# EAGLE design System_Controll (EAGLE 6.4)
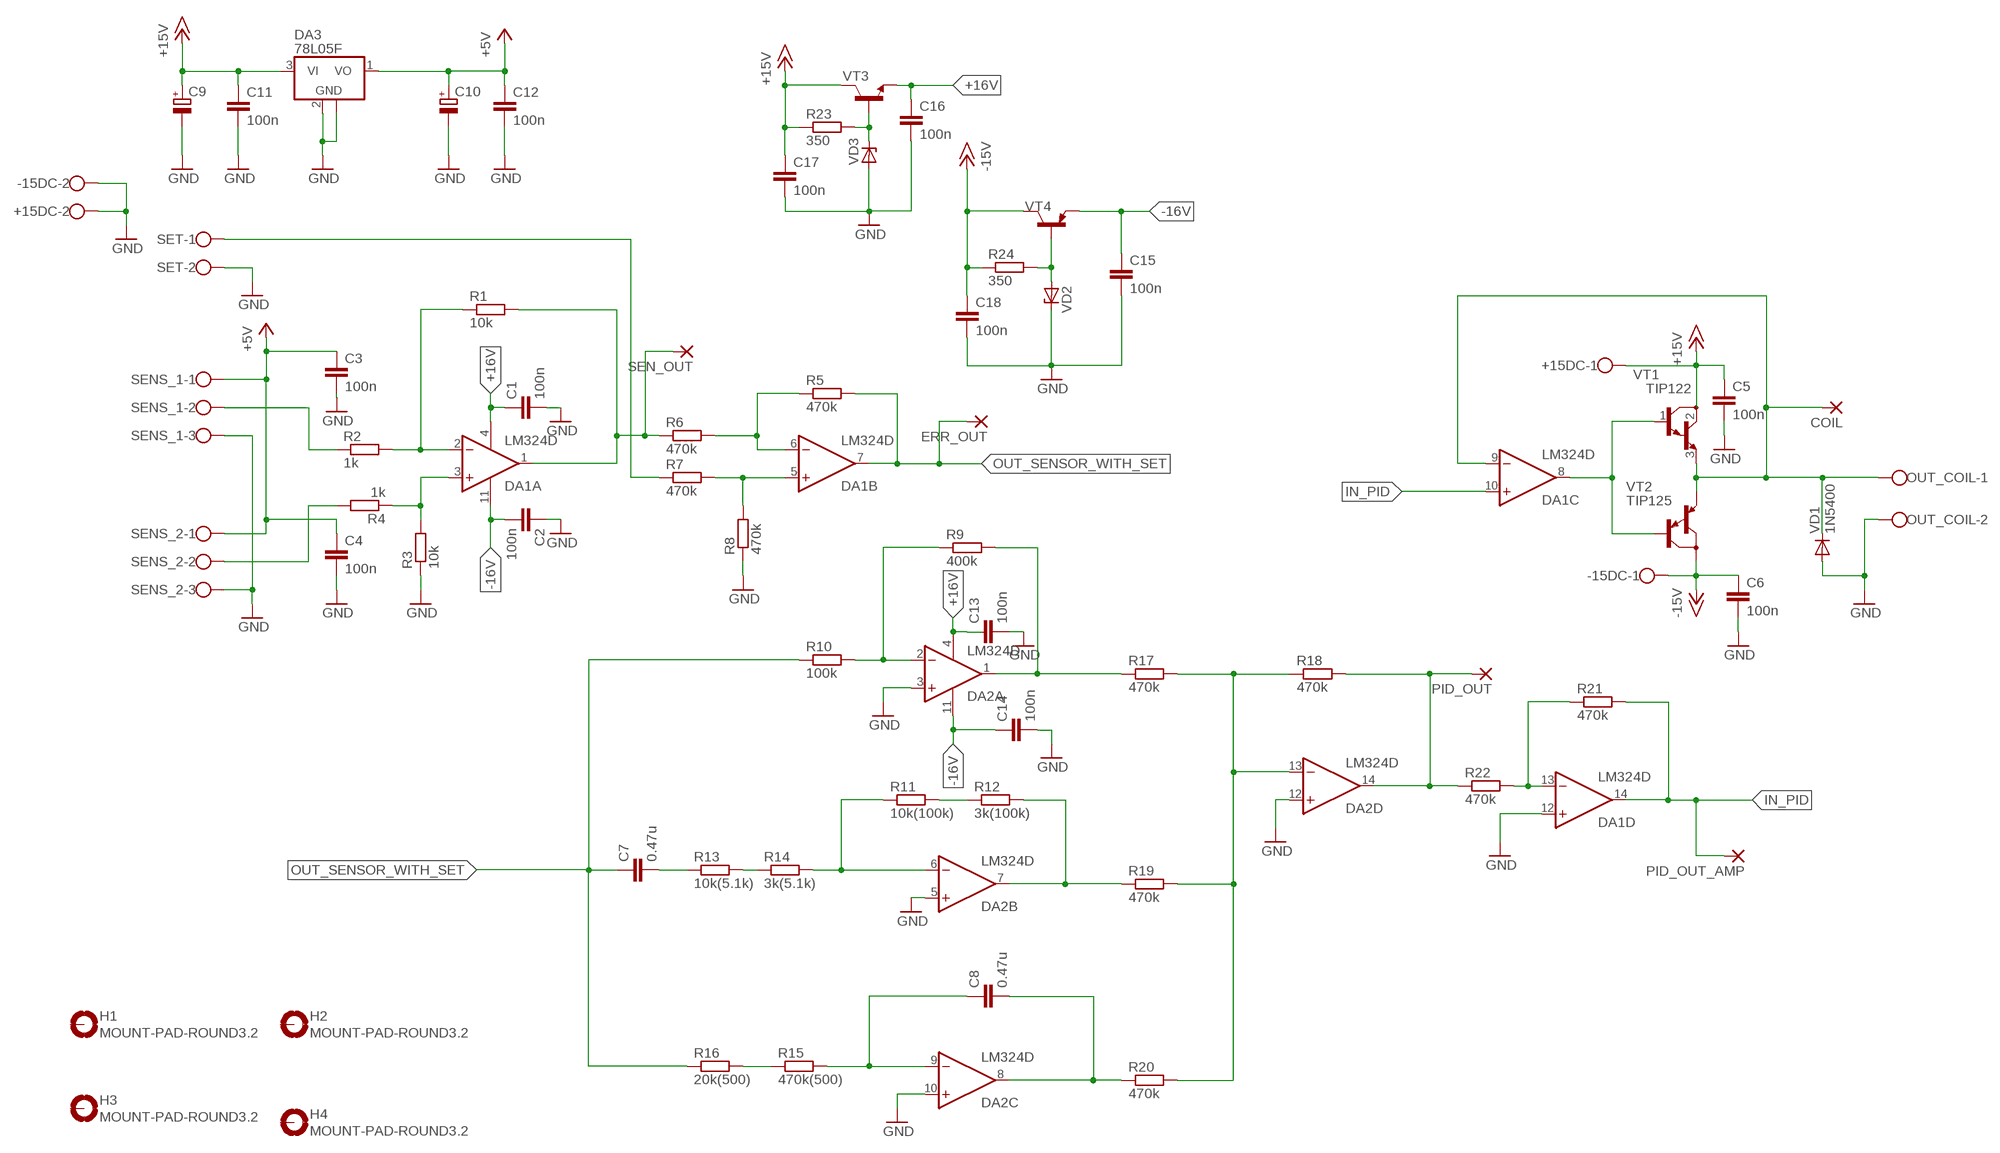
[diagram p0: schematic, sheet 1]

## Parts
+15DC  W237-102  [W237-102]
-15DC  W237-102  [W237-102]
C1  100n  C-EUC1206  [C1206]
C2  100n  C-EUC1206  [C1206]
C3  100n  C-EUC1206  [C1206]
C4  100n  C-EUC1206  [C1206]
C5  100n  C-EUC1206  [C1206]
C6  100n  C-EUC1206  [C1206]
C7  0.47u  C-EUC1206  [C1206]
C8  0.47u  C-EUC1206  [C1206]
C9  CPOL-EUE2,5-6  [E2,5-6]
C10  CPOL-EUE2,5-6  [E2,5-6]
C11  100n  C-EUC1206  [C1206]
C12  100n  C-EUC1206  [C1206]
C13  100n  C-EUC1206  [C1206]
C14  100n  C-EUC1206  [C1206]
C15  100n  C-EUC1206  [C1206]
C16  100n  C-EUC1206  [C1206]
C17  100n  C-EUC1206  [C1206]
C18  100n  C-EUC1206  [C1206]
COIL  PW_PAD  [PW_PAD]
DA1  LM324D  [SO14]
DA2  LM324D  [SO14]
DA3  78L05F  [SOT89]
ERR_OUT  PW_PAD  [PW_PAD]
H1  MOUNT-PAD-ROUND3.2  [3,2-PAD]
H2  MOUNT-PAD-ROUND3.2  [3,2-PAD]
H3  MOUNT-PAD-ROUND3.2  [3,2-PAD]
H4  MOUNT-PAD-ROUND3.2  [3,2-PAD]
OUT_COIL  DG350-3.5-02P  [DG350-3.5-02P]
PID_OUT  PW_PAD  [PW_PAD]
PID_OUT_AMP  PW_PAD  [PW_PAD]
R1  10k  R-EUM1206  [M1206]
R2  1k  R-EUM1206  [M1206]
R3  10k  R-EUM1206  [M1206]
R4  1k  R-EUM1206  [M1206]
R5  470k  R-EUM1206  [M1206]
R6  470k  R-EUM1206  [M1206]
R7  470k  R-EUM1206  [M1206]
R8  470k  R-EUM1206  [M1206]
R9  400k  R-EUM1206  [M1206]
R10  100k  R-EUM1206  [M1206]
R11  10k(100k)  R-EUM1206  [M1206]
R12  3k(100k)  R-EUM1206  [M1206]
R13  10k(5.1k)  R-EUM1206  [M1206]
R14  3k(5.1k)  R-EUM1206  [M1206]
R15  470k(500)  R-EUM1206  [M1206]
R16  20k(500)  R-EUM1206  [M1206]
R17  470k  R-EUM1206  [M1206]
R18  470k  R-EUM1206  [M1206]
R19  470k  R-EUM1206  [M1206]
R20  470k  R-EUM1206  [M1206]
R21  470k  R-EUM1206  [M1206]
R22  470k  R-EUM1206  [M1206]
R23  350  R-EUM1206  [M1206]
R24  350  R-EUM1206  [M1206]
SEN_OUT  PW_PAD  [PW_PAD]
SENS_1  DG350-3.5-03P  [DG350-3.5-03P]
SENS_2  DG350-3.5-03P  [DG350-3.5-03P]
SET  DG350-3.5-02P  [DG350-3.5-02P]
VD1  1N5400  [DO201-15]
VD2  ZENER-DIODEDO41Z10  [DO41Z10]
VD3  ZENER-DIODEDO41Z10  [DO41Z10]
VT1  TIP122  [TO220]
VT2  TIP125  [TO220]
VT3  BC847ALT1SMD  [SOT23]
VT4  BC807-16LT1SMD  [SOT23-BEC]

## Nets
+5V: C3.1 C4.1 C10.+ C12.1 DA3.1(VO) SENS_1.1 SENS_2.1
+15V: +15DC.1 C5.1 C9.+ C11.1 C17.1 DA3.3(VI) R23.1 VT1.2(C) VT3.3(C)
+16V: C1.1 C13.1 C16.1 DA1.4(P:V+) DA2.4(P:V+) VT3.2(E)
-15V: -15DC.1 C6.1 C18.1 R24.1 VT2.2(C) VT4.C
-16V: C2.2 C14.1 C15.1 DA1.11(P:V-) DA2.11(P:V-) VT4.E
COIL_OUT: COIL.P$1(P) DA1.9(C:-IN) OUT_COIL.1 VD1.C VT1.3(E) VT2.3(E)
GND: +15DC.2 -15DC.2 C1.2 C2.1 C3.2 C4.2 C5.2 C6.2 C9.- C10.- C11.2 C12.2 C13.2 C14.2 C15.2 C16.2 C17.2 C18.2 DA1.12(D:+IN) DA2.3(A:+IN) DA2.5(B:+IN) DA2.10(C:+IN) DA2.12(D:+IN) DA3.2(GND) DA3.2@1(GND) OUT_COIL.2 R3.1 R8.1 SENS_1.3 SENS_2.3 SET.2 VD1.A VD2.C VD3.A
IN_PID: DA1.10(C:+IN) DA1.14(D:OUT) PID_OUT_AMP.P$1(P) R21.2
N$1: DA1.1(A:OUT) R1.2 R6.1 SEN_OUT.P$1(P)
N$2: DA1.2(A:-IN) R1.1 R2.2
N$3: DA1.3(A:+IN) R3.2 R4.1
N$4: R2.1 SENS_1.2
N$5: R4.2 SENS_2.2
N$6: DA2.2(A:-IN) R9.1 R10.2
N$7: R7.1 SET.1
N$8: DA1.6(B:-IN) R5.1 R6.2
N$9: DA1.5(B:+IN) R7.2 R8.2
N$11: DA1.8(C:OUT) VT1.1(B) VT2.1(B)
N$12: DA2.1(A:OUT) R9.2 R17.1
N$13: R11.2 R12.1
N$14: DA2.7(B:OUT) R12.2 R19.1
N$15: DA2.6(B:-IN) R11.1 R14.2
N$16: R13.2 R14.1
N$17: C7.2 R13.1
N$18: R24.2 VD2.A VT4.B
N$19: C8.2 DA2.8(C:OUT) R20.1
N$20: C8.1 DA2.9(C:-IN) R15.2
N$21: R15.1 R16.2
N$22: DA2.13(D:-IN) R17.2 R18.1 R19.2 R20.2
N$23: DA2.14(D:OUT) PID_OUT.P$1(P) R18.2 R22.1
N$24: DA1.13(D:-IN) R21.1 R22.2
N$26: R23.2 VD3.C VT3.1(B)
OUT_SENSOR_WITH_SET: C7.1 DA1.7(B:OUT) ERR_OUT.P$1(P) R5.2 R10.1 R16.1
Unconnected: H1.B3,2(MOUNT) H2.B3,2(MOUNT) H3.B3,2(MOUNT) H4.B3,2(MOUNT)

## Library data of the parts
+15DC -15DC = LAMP_RES:W237-102: WAGO SCREW CLAMP; MPN: 237-102; OC_FARNELL: unknown; OC_NEWARK: 70K9898
C1-C8 C11-C18 = Lib_System_Control_AMB:C-EU
C9 C10 = Lib_System_Control_AMB:CPOL-EU
COIL ERR_OUT PID_OUT PID_OUT_AMP SEN_OUT = Lib_System_Control_AMB:PW_PAD: THROUGH-HOLE PAD
DA1 DA2 = Lib_System_Control_AMB:LM324: OP AMP
DA3 = Lib_System_Control_AMB:78L*: POSITOIV-VOLTAGE REGULATORS Output up to 100 mA Source: http://focus.ti.com/lit/ds/symlink/ua78l05.pdf
H1-H4 = LED_CONTROL:MOUNT-PAD-ROUND: MOUNTING PAD, round
OUT_COIL SET = Lib_System_Control_AMB:DG350-3.5-02P: WAGO SCREW CLAMP; MPN: 237-102; OC_FARNELL: unknown; OC_NEWARK: 70K9898
R1-R24 = Lib_System_Control_AMB:R-EU: RESISTOR, European symbol
SENS_1 SENS_2 = Lib_System_Control_AMB:DG350-3.5-03P: WAGO SCREW CLAMP; MPN: 237-103; OC_FARNELL: unknown; OC_NEWARK: 18M7116
VD1 = Lib_System_Control_AMB:1N5400: DIODE standard rectifier, 3 A, 50 V (Motorola)
VD2 VD3 = Lib_System_Control_AMB:ZENER-DIODE: Z-Diode
VT1 = Lib_System_Control_AMB:TIP122*: NPN Darlington Transistor
VT2 = Lib_System_Control_AMB:TIP125: PNP Transistor
VT3 = Lib_System_Control_AMB:BC847*: NPN Transistor
VT4 = Lib_System_Control_AMB:BC807*: PNP Transistror

## Board
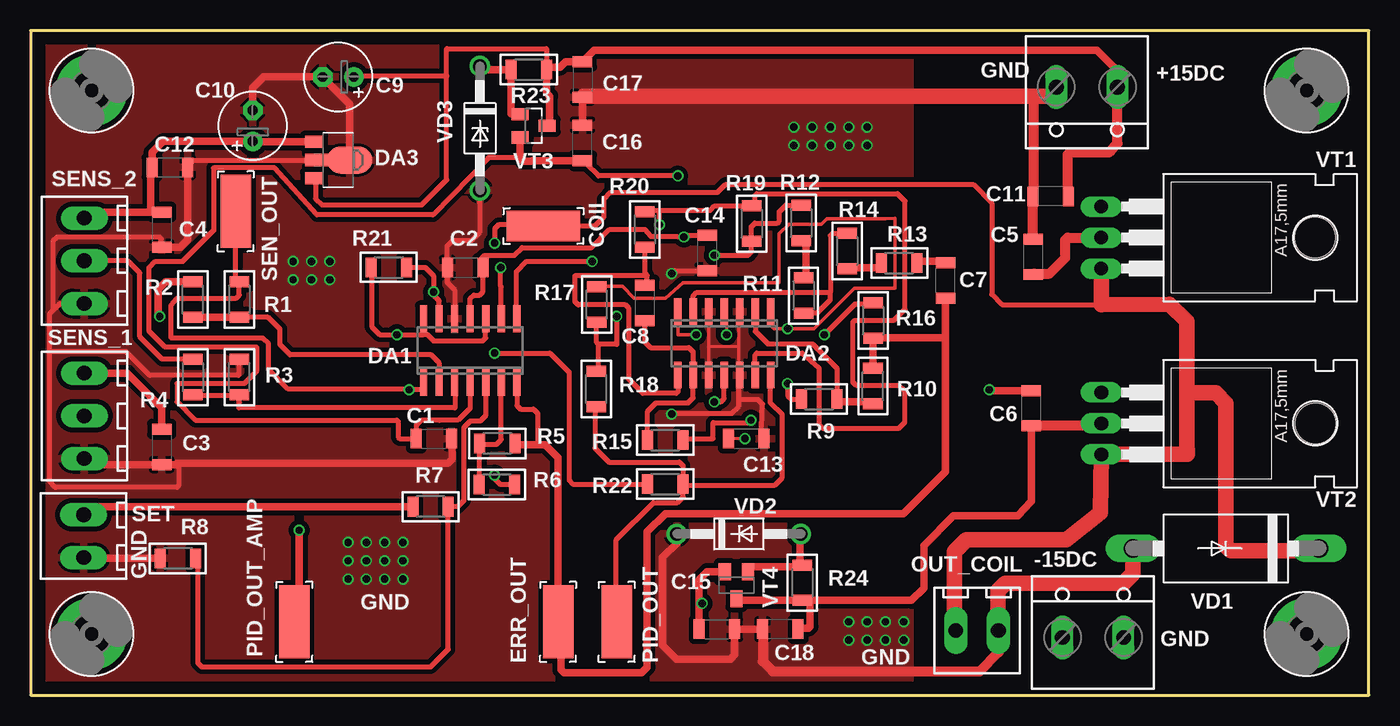
[diagram p1: board, top side]
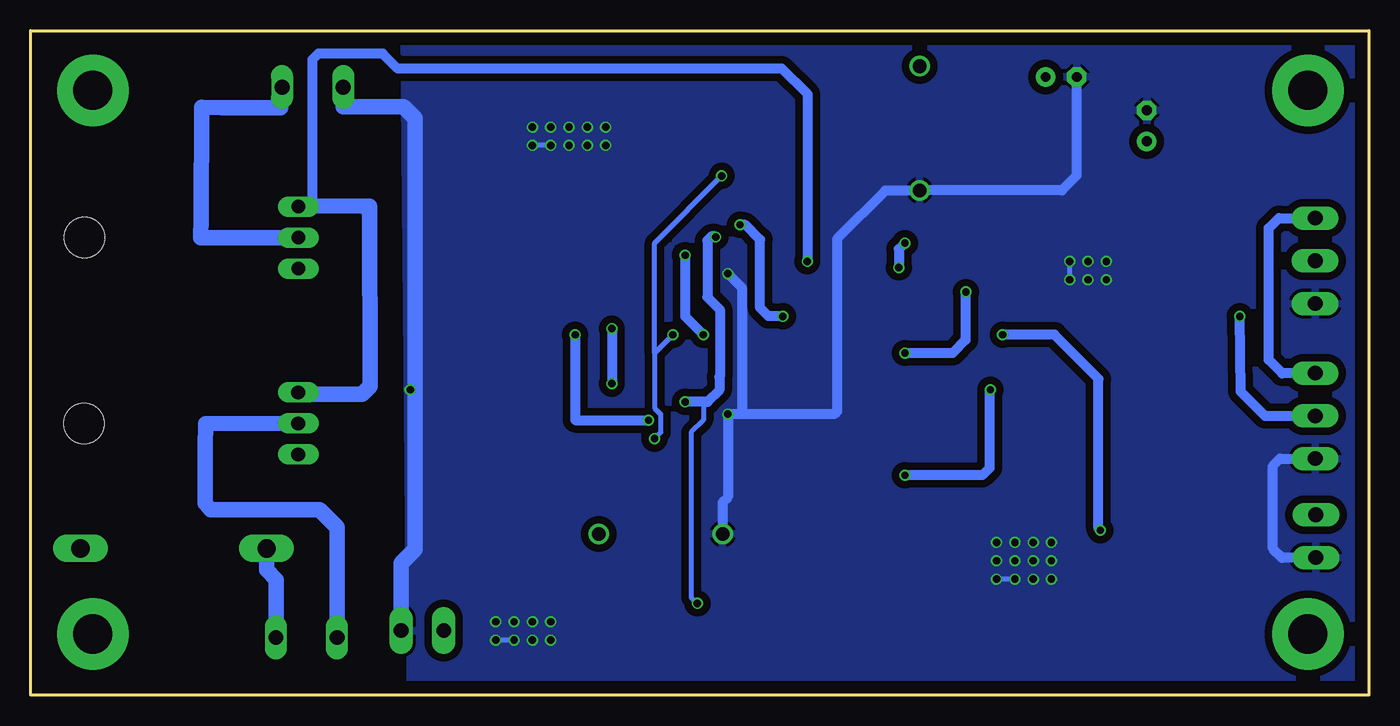
[diagram p2: board, bottom side, seen from below]

Size 109.6 x 54.4 mm. Coordinates in mm from the lower left corner, seen from the top.
Outline: 0,0 109.6,0 109.6,54.4 0,54.4 0,0
Copper layers (1*16): Top 0.035mm / dielectric 1.5mm / Bottom 0.035mm
Design rules "default *": minimum track width 8mil, minimum drill 0.6mm, track to track 8mil, track to pad 8mil, pad to pad 8mil, via to via 8mil, smd to smd 8mil, copper to edge 40mil, drill to drill 8mil, minimum pad ring 10mil, minimum via ring 4mil, stop-mask expansion 4mil, vias tented up to drill 0mil, thermal gap 10mil

### Footprints (pad centres in the part's own frame; a part is rotated, then mirrored left to right if it is on the bottom)
W237-102 = drill 1.2 long: 1 -2.5,-1.27; 2 2.5,-1.27
C1206 = smd 0.9 x 1.6: 1 -1.45,0; 2 1.45,0
E2,5-6 = drill 0.8 pad 1.6: + -1.27,0 | drill 0.8 pad 1.6 octagon: - 1.27,0
PW_PAD = smd 6 x 2.5: P$1 0,0
SO14 = smd 0.6 x 2.2: 1 -3.81,-2.6; 2 -2.54,-2.6; 3 -1.27,-2.6; 4 0,-2.6; 5 1.27,-2.6; 6 2.54,-2.6; 7 3.81,-2.6; 8 3.81,2.6; 9 2.54,2.6; 10 1.27,2.6; 11 0,2.6; 12 -1.27,2.6; 13 -2.54,2.6; 14 -3.81,2.6
SOT89 = smd 1 x 1.5: 1 -1.499,-1.981; 3 1.499,-1.981 | smd 1 x 2: 2 0,-1.727 | smd 2.2 x 3.7: 2@1 0,0.94
3,2-PAD = drill 3.2 pad 5.842: B3,2 0,0
DG350-3.5-02P = drill 1.2 pad 1.93 long: 1 -1.75,0; 2 1.75,0
M1206 = smd 0.9 x 1.6: 1 -1.45,0; 2 1.45,0
DG350-3.5-03P = drill 1.2 pad 1.93 long: 1 -3.5,0; 2 0,0; 3 3.5,0
DO201-15 = drill 1.499 long: A 7.62,0; C -7.62,0
DO41Z10 = drill 1.118: A 5.08,0; C -5.08,0
TO220 = drill 1.118 long: 1 -2.54,-6.35; 2 0,-6.35; 3 2.54,-6.35 | hole 3.302: 0,11.176
SOT23 = smd 1 x 1.4: 1 -0.95,-1.1; 2 0.95,-1.1; 3 0,1.1
SOT23-BEC = smd 1 x 1.4: B -0.95,-1.1; C 0,1.1; E 0.95,-1.1

### Placement (x,y rotation side)
+15DC  86.5,48.49 180 top
-15DC  87,6 0 top
C1  33.04,20.99 0 top
C2  35.6,35 0 top
C3  10.75,20.32 270 top
C4  10.75,38.09 270 top
C5  82.11,35.88 90 top
C6  81.95,23.48 90 top
C7  74.92,33.95 90 top
C8  50.31,32.11 90 top
C9  25.2,50.6 180 top
C10  18.2,46.6 90 top
C11  83.53,40.83 180 top
C12  11.4,43.2 0 top
C13  58.6,21 0 top
C14  55.4,36.2 270 top
C15  56.2,5.4 0 top
C16  45.2,45.2 90 top
C17  45.2,50.4 270 top
C18  61.4,5.4 180 top
COIL  42,38.4 0 top
DA1  36,28.2 0 top
DA2  56.8,28.8 180 top
DA3  25.2,43.8 270 top
ERR_OUT  43.2,6 90 top
H1  5,49.5 0 top
H2  5,5 0 top
H3  104.5,5 0 top
H4  104.5,49.5 0 top
OUT_COIL  77.51,5.28 0 top
PID_OUT  48,6 90 top
PID_OUT_AMP  21.6,6 90 top
R1  17.1,32.38 90 top
R2  13.29,32.38 270 top
R3  17.1,26.03 270 top
R4  13.29,26.03 90 top
R5  38.23,20.6 0 top
R6  38.18,17.24 180 top
R7  32.76,15.42 0 top
R8  12.06,11.19 0 top
R9  64.57,24.23 180 top
R10  68.98,25.3 270 top
R11  63.3,32.7 90 top
R12  63.1,38.65 90 top
R13  71.14,35.36 180 top
R14  66.87,36.35 90 top
R15  51.98,20.87 180 top
R16  68.99,30.66 90 top
R17  46.36,31.98 270 top
R18  46.32,25.06 270 top
R19  59.05,38.59 90 top
R20  50.3,38.12 90 top
R21  29.33,35.02 180 top
R22  51.98,17.28 180 top
R23  40.8,51.2 180 top
R24  63.2,9.2 90 top
SEN_OUT  16.8,39.6 270 top
SENS_1  4.4,22.86 270 top
SENS_2  4.4,35.55 270 top
SET  4.35,13.01 270 top
VD1  97.89,12.01 180 top
VD2  58,13.2 0 top
VD3  36.8,46.4 270 top
VT1  94.02,37.45 270 top
VT2  94.03,22.24 270 top
VT3  41.2,46.6 270 top
VT4  57.8,9 180 top

### Tracks (layer width: path | path; a pad name or v marks a point on that pad's centre or on a via)
+5V
  Top 0.254: 10.5,22 C3.1 | 23,45.5 DA3.1
  Top 0.406: SENS_1.1
  Top 0.61: SENS_2.1 4.89,39.55 9.84,39.55 | 9.84,39.55 C4.1 | 9.84,39.55 9.84,43.09 C12.1 9.96,44.42 10.87,45.33 C10.+ 18.23,45.3 DA3.1 | SENS_1.1 7.93,26.36 10.75,23.54 C3.1
  Bottom 0.406: SENS_1.1 4.42,26.34
  Bottom 0.813: 4.42,26.34 7.11,26.34 8.21,27.44 8.21,38.22 7.38,39.05 SENS_2.1
+15V
  Top 0.254: 85,41 C11.1 | 89,48 +15DC.1 | 23.5,42 DA3.3 | 42,46.5 VT3.3 | 45,51.5 C17.1 | 42.5,51.5 R23.1
  Top 0.406: 23.5,42 23.34,41.84 23.34,40.64 23.86,40.12 32.04,40.12 34.07,42.18 34.07,50.68 | 34.07,50.68 34.07,52.92 42.25,52.92 R23.1 | C9.+ 26.55,50.68 34.07,50.68 | 88.22,51.89 88.23,51.89
  Top 0.61: 42.5,51.5 42.59,51.41 43.37,51.41 43.81,51.85 C17.1 45.24,51.89 46.13,52.78 87.33,52.78 88.22,51.89 | 88.23,51.89 89.1,51.02 +15DC.1 | VT3.3 42.51,46.81 42.51,49.03 42.25,49.29 R23.1 | 85,41 85.05,40.95 | C5.1 82.13,34.45
  Top 0.813: 85.05,40.95 84.93,41.07 84.93,44.25 85.13,44.45 88.38,44.45 89.01,45.16 +15DC.1 | 82.13,34.45 82.18,34.5 83.44,34.5 84.73,35.79 84.73,37.27 84.91,37.45 VT1.2
  Bottom 1.27: +15DC.1 89.13,48.1 93.93,48.1 95.6,48.13 95.64,39.09 95.65,37.44 VT1.2
+16V  (via drill 0.6)
  Top 0.254: 40.5,45.5 VT3.2 | 57,21 C13.1 v58.5,21 | v57,29.5 57,31 DA2.4 | 45.5,43.5 C16.1 | 31.5,21 C1.1
  Top 0.406: DA1.4 36,23.5 35,22.5 33.5,22.5 33.49,22.49 31.98,22.49 31.59,22.1 31.59,21.13 C1.1 30.24,20.99 30.12,21.11 30.12,22.38 30,22.5 13.5,22.5 12,24 12,25.5 17.5,25.5 18.5,26.5 18.5,28.5 11,28.5 9.7,29.8 9.7,34.99 10.21,35.5 12,35.5 12.01,35.51 12.46,35.51 15,38.05 14.98,43.16 19.98,43.16 23.45,39.31 32.95,39.31 37.5,44 40.1,44 | 45.5,43.5 46.5,42.5 v53,42.5
  Top 0.61: C16.1 45.18,43.73 41.02,43.73 41,43.71 40.32,43.71 40.1,43.93 40.1,44 VT3.2
  Bottom 0.406: v58.5,21 58,21.5 58,23 58.5,23.5 58.5,28 | v57,29.5 58.5,28 | v53,42.5 58.5,37 58.5,28
-15V
  Top 0.254: 82,22 C6.1 81.5,22 | 58,8 VT4.C | 63,5.5 C18.1
  Top 0.61: 57.92,7.92 57.78,7.79 57.78,7.62 | 82,22 82.01,21.99 82.02,22.11 | 63.84,7.75 72.15,7.75 73.15,8.75 73.15,12.24 75.59,14.68 80.87,14.68 81.9,15.81 81.95,15.88 C6.1 | 63.84,7.75 R24.1 58.15,7.75 57.92,7.52 57.92,7.92 | 63,5.5 63.02,5.48 63.72,5.48 63.84,5.6 63.84,7.75 | 58,8 57.92,7.92
  Top 0.813: 82.02,22.11 82.05,22.08 83.97,22.08 87.68,22.07 VT2.2
  Bottom 1.27: VT2.2 95.27,22.23 95.28,20.3 95.28,20.19 95.3,15.72 94.83,15.17 85.94,15.17 84.5,13.73 -15DC.1
-16V  (via drill 0.6)
  Top 0.254: 55,37.5 C14.1 | 37,35 C2.2 | 56.5,10 VT4.E | v55,7.5 54.73,7.5
  Top 0.406: DA1.11 36,32.47 36.28,32.75 36.77,32.75 37.05,33.03 C2.2 | 37,35 36.97,35.03 36.97,35.8 37.16,35.99 39.6,35.99 40.24,36.63 45.94,36.63 47.43,38.12 49.81,38.12 49.82,38.13 50.28,38.13 50.77,37.55 52.9,37.55 53.04,37.5 v53.5,37.5 53.65,37.65 C14.1 | v56,24 56.02,24.02 56.55,24.02 56.8,24.27 DA2.11
  Top 0.61: VT4.E 55.4,10.1 54.73,9.43 54.73,7.5 54.73,5.42 C15.1
  Bottom 0.406: v55,7.5 55.5,8 55.5,21.5 54.5,22.5 54.5,24
  Bottom 0.813: v53.5,37.5 53.56,37.56 53.85,37.56 54.18,37.23 54.18,32.57 53.16,31.55 53.16,26.08 53.2,26.04 53.2,24.96 54.16,24 54.5,24 v56,24
COIL_OUT  (via drill 0.6)
  Top 0.254: 38.5,31 DA1.9 | 42,38 COIL.P$1 42,38.5
  Top 0.406: 42,38 41.5,38.5 38.32,38.5 38,38.18 v38,37 | 42,38.5 42.06,38.44 46.24,38.44 46.95,39.15 46.95,40.61 47.49,41.15 56.25,41.15 56.91,41.81 77.19,41.81 78.72,40.28 78.72,32.8 79.55,31.97 87.67,31.97 | 38.5,31 38.55,31.05 38.55,33.42 38.5,33.47 v38.5,35
  Top 1.27: OUT_COIL.1 75.66,5.38 75.66,11.75 76.63,12.72 84.83,12.72 87.61,14.94 VT2.3 94.71,19.71 94.68,20.73 94.68,24.74 | VT1.3 87.67,31.97 93.27,31.98 94.68,30.61 94.68,24.74 | VD1.C 105.3,11.8 98.3,11.8 97.89,12.21 97.89,23.9 97.05,24.74 94.68,24.74
  Bottom 0.813: v38,37 38.5,36.5 v38.5,35
GND  (via drill 0.6)
  Top 0.254: 81.5,25 C6.2 | 17,27.5 R3.1 | 4.5,32 SENS_2.3 | 10.5,11.5 R8.1 | 10.5,19 C3.2 11,19 | 34.5,20.5 C1.2 | 55.5,28.5 55.5,31 DA2.5 | 55.5,28.5 55.5,26.5 DA2.10 | 58,25.5 58,26 DA2.12 58,26.5 58,28.5 | 60,21 C13.2 | 58,28.5 58,31 DA2.3 | 58,28.5 55.5,28.5 | 60,5.5 C18.2 60,5 | 55,34.5 C14.2 | 57.5,5 C15.2 | 12.5,43 C12.2 13,43.5 | 24.5,44 26,44 DA3.2@1 24.5,44 | 24.5,44 23.5,44 DA3.2 | 24,50.5 C9.- | 79,5 OUT_COIL.2
  Top 0.406: DA1.12 34.76,30.83 34.76,33.13 34.15,33.74 C2.1 34.2,35.05 34.12,35.13 34.12,36.76 34.59,37.23 36.13,37.23 36.8,37.9 VD3.A | 13,43.5 13.3,43.8 DA3.2 | 10.5,19 10.35,18.85 | SET.2 4.42,11.19 | 12,19 12.13,18.87 12.13,17.13 12.01,17.01 2.04,17.01 1.56,17.49 1.56,28.11 | 1.56,28.11 1.56,31.21 1.82,31.47 | 1.82,31.47 2.4,32.05 SENS_2.3 | 17,27.5 17.06,27.44 17.06,26.2 17.04,26.18 9.77,26.18 7.84,28.11 1.56,28.11 | C4.2 10.71,36.69 10.71,37.34 10.56,37.49 2.17,37.49 1.82,37.14 1.82,31.47 | v52.5,23 52.56,23.06 57.41,23.06 58,23.65 58,24.19 | 58,24.19 58,25.5 | 60,21 59.83,21.02 59.95,23.82 59.58,24.19 58,24.19 | v52.5,34.5 52.75,34.75 C14.2
  Top 0.61: v78.5,25 78.57,24.93 C6.2 | C15.2 C18.2 | 60,5 59.97,4.97 | 57.5,5 57.66,4.84 57.66,3.29 57.32,2.95 52.91,2.95 51.77,4.09 51.77,11.28 52.92,12.43 VD2.C | C16.2 C17.2 45.28,49.03 | 83.89,49.03 84.1,48.82 | C11.2 82.15,40.9 | C5.2 82.08,37.36 | C10.- 18.19,49.71 19.08,50.6 C9.- | 24,50.5 26.14,48.36 DA3.2@1 | C4.2 10.79,36.68 12.25,36.68 12.85,37.28 C12.2 | 10.35,18.85 5.1,18.85 4.59,19.36 SENS_1.3 | 4.42,11.19 R8.1 | 34.5,20.5 34.5,19.29 34.21,19 12,19 11.87,18.86 C3.2
  Top 0.813: 59.97,4.97 59.97,2.77 60.79,1.95 77.72,1.95 79.26,3.49 OUT_COIL.2 | 82.15,40.9 82.15,49.03 | 82.08,37.36 C11.2
  Top 1.27: OUT_COIL.2 79.22,5.32 79.22,8.54 79.82,9.14 89.47,9.14 90.27,9.94 VD1.A | 45.28,49.03 82.15,49.03 83.89,49.03 | 84.1,48.82 +15DC.2
  Bottom 0.254: v78.5,25 78.12,25
  Bottom 0.406: SET.2 4.38,11.23 | v29,9.5 v30.5,9.5 | v24.5,34 v24.5,35.5 | v67,45 v68.5,45 | v70,4.5 v71.5,4.5
  Bottom 0.813: 4.38,11.23 7.11,11.23 7.87,11.99 7.87,18.77 7.29,19.36 SENS_1.3 | C9.- 23.94,42.52 25.14,41.32 VD3.A 36.82,41.3 39.61,41.3 43.56,37.35 43.56,23.22 43.78,23 51.36,23 | 51.36,23 v52.5,23 v52.49,22.99 52.49,16.2 52.92,15.77 VD2.C | v52.5,34.5 51.36,33.36 51.36,23
  Bottom 1.27: -15DC.2 89.47,4.76 89.47,9.46 90.27,10.26 VD1.A | +15DC.2 84.01,48.16 79.04,48.16 78.12,47.24 78.12,25 78.12,11.92 79.26,10.78 OUT_COIL.2
  other vias: 26,12.5 27.5,12.5 29,12.5 30.5,12.5 26,11 27.5,11 29,11 30.5,11 26,9.5 27.5,9.5 21.5,35.5 21.5,34 23,34 23,35.5 62.5,46.5 62.5,45 64,46.5 64,45 65.5,46.5 65.5,45 67,46.5 68.5,46.5 67,6 68.5,6 70,6 71.5,6 67,4.5 68.5,4.5
  pour Top (isolate 0.4): 1.5,53.5 1.5,1 72,1 72,53.5
  pour Bottom (isolate 0.61): 1,53.5 1,1 78.5,1 79,53.5
IN_PID  (via drill 0.6)
  Top 0.254: 28,35 R21.2 | 22,6 PID_OUT_AMP.P$1
  Top 0.406: 32.2,29.5 v30,29.5 28.6,29.5 27.94,30.16 27.94,34.94 28,35 | 32.2,29.5 32.19,29.51 DA1.14 | 32.2,29.5 32.5,29.5 33,29 37.03,29 37.27,29.24 DA1.10
  Top 0.61: v22,13.5 22,6
  Bottom 0.406: v22,13.5 22.14,13.64
  Bottom 0.813: 22.14,13.64 22.14,25.88 25.76,29.5 v30,29.5
N$1  (via drill 0.6)
  Top 0.254: 17,34 R1.2 17,33.5 | 17,39.5 SEN_OUT.P$1 | 39.5,17.5 R6.1
  Top 0.406: DA1.1 32.17,25.58 32.17,24.94 32.11,25 v31,25 30.96,25.04 21.1,25.04 19.48,26.66 19.48,28.77 19.02,29.23 11.52,29.23 11.51,29.33 11.51,31.9 12.01,32.49 16.84,32.49 17.1,32.75 R1.2 | 17,34 16.8,34.2 SEN_OUT.P$1 | 39.5,17.5 39.24,17.24 38.47,17.24 38,17.71 v38,18
  Bottom 0.406: v31,25 31.07,24.93
  Bottom 0.813: 31.07,24.93 31.07,18.59 31.66,18 v38,18
N$2
  Top 0.254: 13.5,31 R2.2 | 17,31 R1.1 | 33.5,26 DA1.2
  Top 0.406: 33.5,26 33.48,26.02 33.48,27.16 32.79,27.85 21.25,27.85 20.42,28.68 20.42,29.95 19.44,30.93 R1.1
  Top 0.61: 13.5,31 13.57,30.93 R1.1
N$3
  Top 0.254: 13.5,24.5 R4.1 | 17,24.5 R3.2
  Top 0.406: 17,24.5 13.5,24.5 | DA1.3 34.75,25.58 34.75,23.52 17.07,23.52 17.1,23.96 R3.2
N$4  (via drill 0.6)
  Top 0.254: 13,33.5 R2.1
  Top 0.61: v10.57,31 10.47,31.03 10.47,33.24 11.06,33.83 R2.1
  Bottom 0.406: SENS_1.2 4.42,22.83
  Bottom 0.813: 4.42,22.83 8.49,22.83 10.5,24.84 v10.57,31
N$5
  Top 0.254: 13,27.5 R4.2
  Top 0.406: 13,27.5 12.99,27.51 10.77,27.51 8.94,29.34 8.94,34.56 7.95,35.55 SENS_2.2
N$6
  Top 0.254: 68.5,24 R10.2 | 66,24 R9.1 66,24.5
  Top 0.406: DA2.2 59.35,29.78 60.38,28.75 64.03,28.75 66.02,26.76 R9.1
  Top 0.61: 66,24 68.5,24
N$7
  Top 0.254: 31,15 R7.1
  Top 0.61: SET.1 5.01,15.42 R7.1
N$8
  Top 0.254: 37,20.5 R5.1 | 38.5,25.5 DA1.6
  Top 0.406: DA1.6 38.54,20.91 38.16,20.53 36.85,20.53 R5.1 36.78,17.29 R6.2
N$9
  Top 0.254: 34.5,15.5 R7.2
  Top 0.406: R8.2 13.69,11.01 13.69,2.64 14.02,2.31 32.77,2.31 34.21,3.75 R7.2 34.99,15.42 35.48,15.91 35.48,21.89 36.01,22.42 36.83,22.42 37.26,22.85 DA1.5
N$11  (via drill 0.6)
  Top 0.406: DA1.8 39.78,30.83 39.78,34.67 40.61,35.5 v46,35.5
  Bottom 0.813: v46,35.5 45.95,35.55 45.95,49.17 48.07,51.29 79.53,51.29 80.76,52.52 86.03,52.52 86.53,52.02 86.53,50.6 86.53,50.1 86.53,40.05
  Bottom 1.27: VT2.1 86.55,24.62 82.46,24.62 81.8,25.28 81.83,40.01 82.42,40.01 86.53,40.05 VT1.1
N$12  (via drill 0.6)
  Top 0.254: 63,24.5 R9.2
  Top 0.305: 60.6,30.29 60.89,30 v62,30 64.16,30 67.45,33.29 70.78,33.29 70.78,39.02 70,39.01 65.23,39.01 64.78,38.56 62.1,38.56 61.29,37.75 61.29,33.77 53.44,33.77 52,32.5 49.41,32.5 48.46,33.45 46.38,33.45 R17.1
  Top 0.406: v62,25.5 62,24.52 62.29,24.23 R9.2 | DA2.1 60.6,30.29
  Bottom 0.813: v62,30 v62,25.5
N$13
  Top 0.254: 63.5,34.5 R11.2 | 63.5,37 R12.1
  Top 0.61: 63.5,37 63.5,34.5
N$14  (via drill 0.6)
  Top 0.254: 63,40 R12.2 | 53,31 DA2.7 | 59,37 R19.1
  Top 0.305: 53,31 53,29.5 v54.5,29.5
  Top 0.406: v56,36 v56.01,36.01 58.78,36.01 59.05,36.28 R19.1 59.03,37.16 59.03,38.35 59.32,38.64 61.16,38.64 61.32,38.8 61.32,39.57 61.85,40.1 R12.2
  Bottom 0.813: v54.5,29.5 56,31 v56,36
N$15
  Top 0.254: 63.5,31.5 R11.1
  Top 0.406: 63.5,31.5 63.7,31.3 64.44,31.3 65.5,32.36 65.5,32.96 | DA2.6 54.25,32.66 54.55,32.96 65.5,32.96 | 65.5,32.96 65.5,37.61 65.67,37.78 66.22,37.78 66.24,37.8 R14.2
N$16
  Top 0.254: 67,35 R14.1 | 69.5,35 R13.2
  Top 0.61: 69.5,35 67,35
N$17
  Top 0.254: 73,35.5 R13.1 | 74.5,35.5 C7.2
  Top 0.61: 74.5,35.5 73,35.5
N$18
  Top 0.254: 59,10.5 VT4.B | 63,10.5 R24.2
  Top 0.61: 63,10.5 59,10.5 | R24.2 63,11 63,13 VD2.A
N$19
  Top 0.254: 50.5,36.5 R20.1 | 53,26 DA2.8
  Top 0.406: DA2.8 53,26.17 53,26 53,24.81 52.88,24.69 50.15,24.69 49,25.84 49,31.66 48.72,31.94 44.85,31.94 44.58,32.21 44.58,34.29 44.64,34.35 50.5,34.35 | C8.2 50.5,33.75 50.5,34.35 | 50.5,34.35 50.3,34.55 R20.1
N$20
  Top 0.254: 50.5,21 R15.2 | 50.5,30.5 C8.1
  Top 0.406: 50.5,21 50.53,21.03 50.53,23.25 51.2,23.92 53.85,23.92 54.26,24.33 DA2.9 54.26,28.09 53.91,28.44 50.75,28.44 50.31,28.88 C8.1 | 50.5,30.5 50.52,30.48
N$21  (via drill 0.6)
  Top 0.254: 53.5,21 R15.1 | 68.5,32 R16.2
  Top 0.406: v65,29.5 67.5,32 68.5,32 | 53.5,21 55.89,21 55.89,22.3 59,22.3 v59,22.5
  Bottom 0.813: v59,22.5 65,22.5 v65,29.5
N$22  (via drill 0.6)
  Top 0.254: 46.5,26.5 R18.1 | 59.5,40 R19.2 | 46.5,30.5 R17.2 | 50.5,39.5 R20.2
  Top 0.406: 50.5,39.5 50.68,39.68 51.49,39.68 | 51.49,39.68 55.66,39.68 56.02,40.04 R19.2 | v51.5,38.5 v51.49,38.51 51.49,39.68 | v48,31 48,28.71 46.5,28.71 | 46.5,26.5 46.5,28.71 | 46.5,28.71 46.36,28.85 R17.2 | DA2.13 59.34,27.86 59.47,27.99 63.2,27.99 64.56,26.81 64.56,25.12 64.57,25.11 64.57,22.15 64.86,21.86 71.12,21.86 71.59,22.33 71.59,24.87 71.13,25.33 67.64,25.33 67.34,25.63 67.34,30.52 67.49,30.67 70.7,30.67 71.61,31.58 71.61,40.44 70.99,41.06 59.47,41.06 59.32,40.91 59.32,40.18 59.5,40
  Bottom 0.813: v48,31 48.02,31.02 49.19,31.02 49.86,31.69 49.86,37.29 51.07,38.5 v51.5,38.5
N$23
  Top 0.254: 46,23.5 R18.2
  Top 0.406: R22.1 53.53,17.18 60.95,17.18 61.57,17.8 61.57,22.95 60.61,23.91 DA2.14 | PID_OUT.P$1 47.95,6.05 47.95,12.7 51,15.75 52.97,15.75 53.43,16.21 R22.1 | 46,23.5 46.22,23.28 46.22,20.22 47.37,19.07 53.13,19.07 53.43,18.77 R22.1
N$24  (via drill 0.6)
  Top 0.254: 33.5,31 DA1.13 | 50.5,17.5 R22.2
  Top 0.406: R21.1 32.33,35.01 33,34.34 v33,33 33,32.73 33.46,32.27 33.46,31.04 33.5,31 | v38,28 38.03,27.97 38.06,28 42.53,28 44.1,26.43 44.1,17.57 44.39,17.28 R22.2
  Bottom 0.406: v33,33 33.03,32.97
  Bottom 0.813: 33.03,32.97 33.03,29.08 34.11,28 v38,28
N$26
  Top 0.61: VD3.C 37.24,51.48 37.52,51.2 R23.2 39.35,47.59 40.06,47.59 VT3.1
OUT_SENSOR_WITH_SET
  Top 0.254: 69,27 R10.1 69,26.5 | 74.5,32.5 C7.1 | 40,21 R5.2 40,20.5 | 43,6 ERR_OUT.P$1 | 69,29 R16.1
  Top 0.406: DA1.7 39.83,25.58 39.83,23.69 40.11,23.41 41.19,23.41 41.53,23.07 41.53,20.49
  Top 0.61: 69,27 69,29 69.24,29.24 74.92,29.24 | 43,6 43.44,5.56 43.44,2.07 43.69,1.82 50.02,1.82 50.5,2.3 50.5,13.37 51.98,14.85 71.49,14.85 74.92,18.28 74.92,29.24 | 74.92,29.24 C7.1 | 40,20.5 40.01,20.49 41.53,20.49 42.15,20.49 43.2,19.44 ERR_OUT.P$1

### Text on the board
tNames: GND | GND | GND | GND | GND
Document: GND